# EasyEDA Pro project Valmar.eprj

# Schematic Main
Board Name: Main; Create Date: 2025-05-15; Page Name: P1; Project Name: Valmar; Schematic Name: Main; Update Date: 2025-05-19; Company: EasyEDA.com; Page Size: A4; Version: V1.0
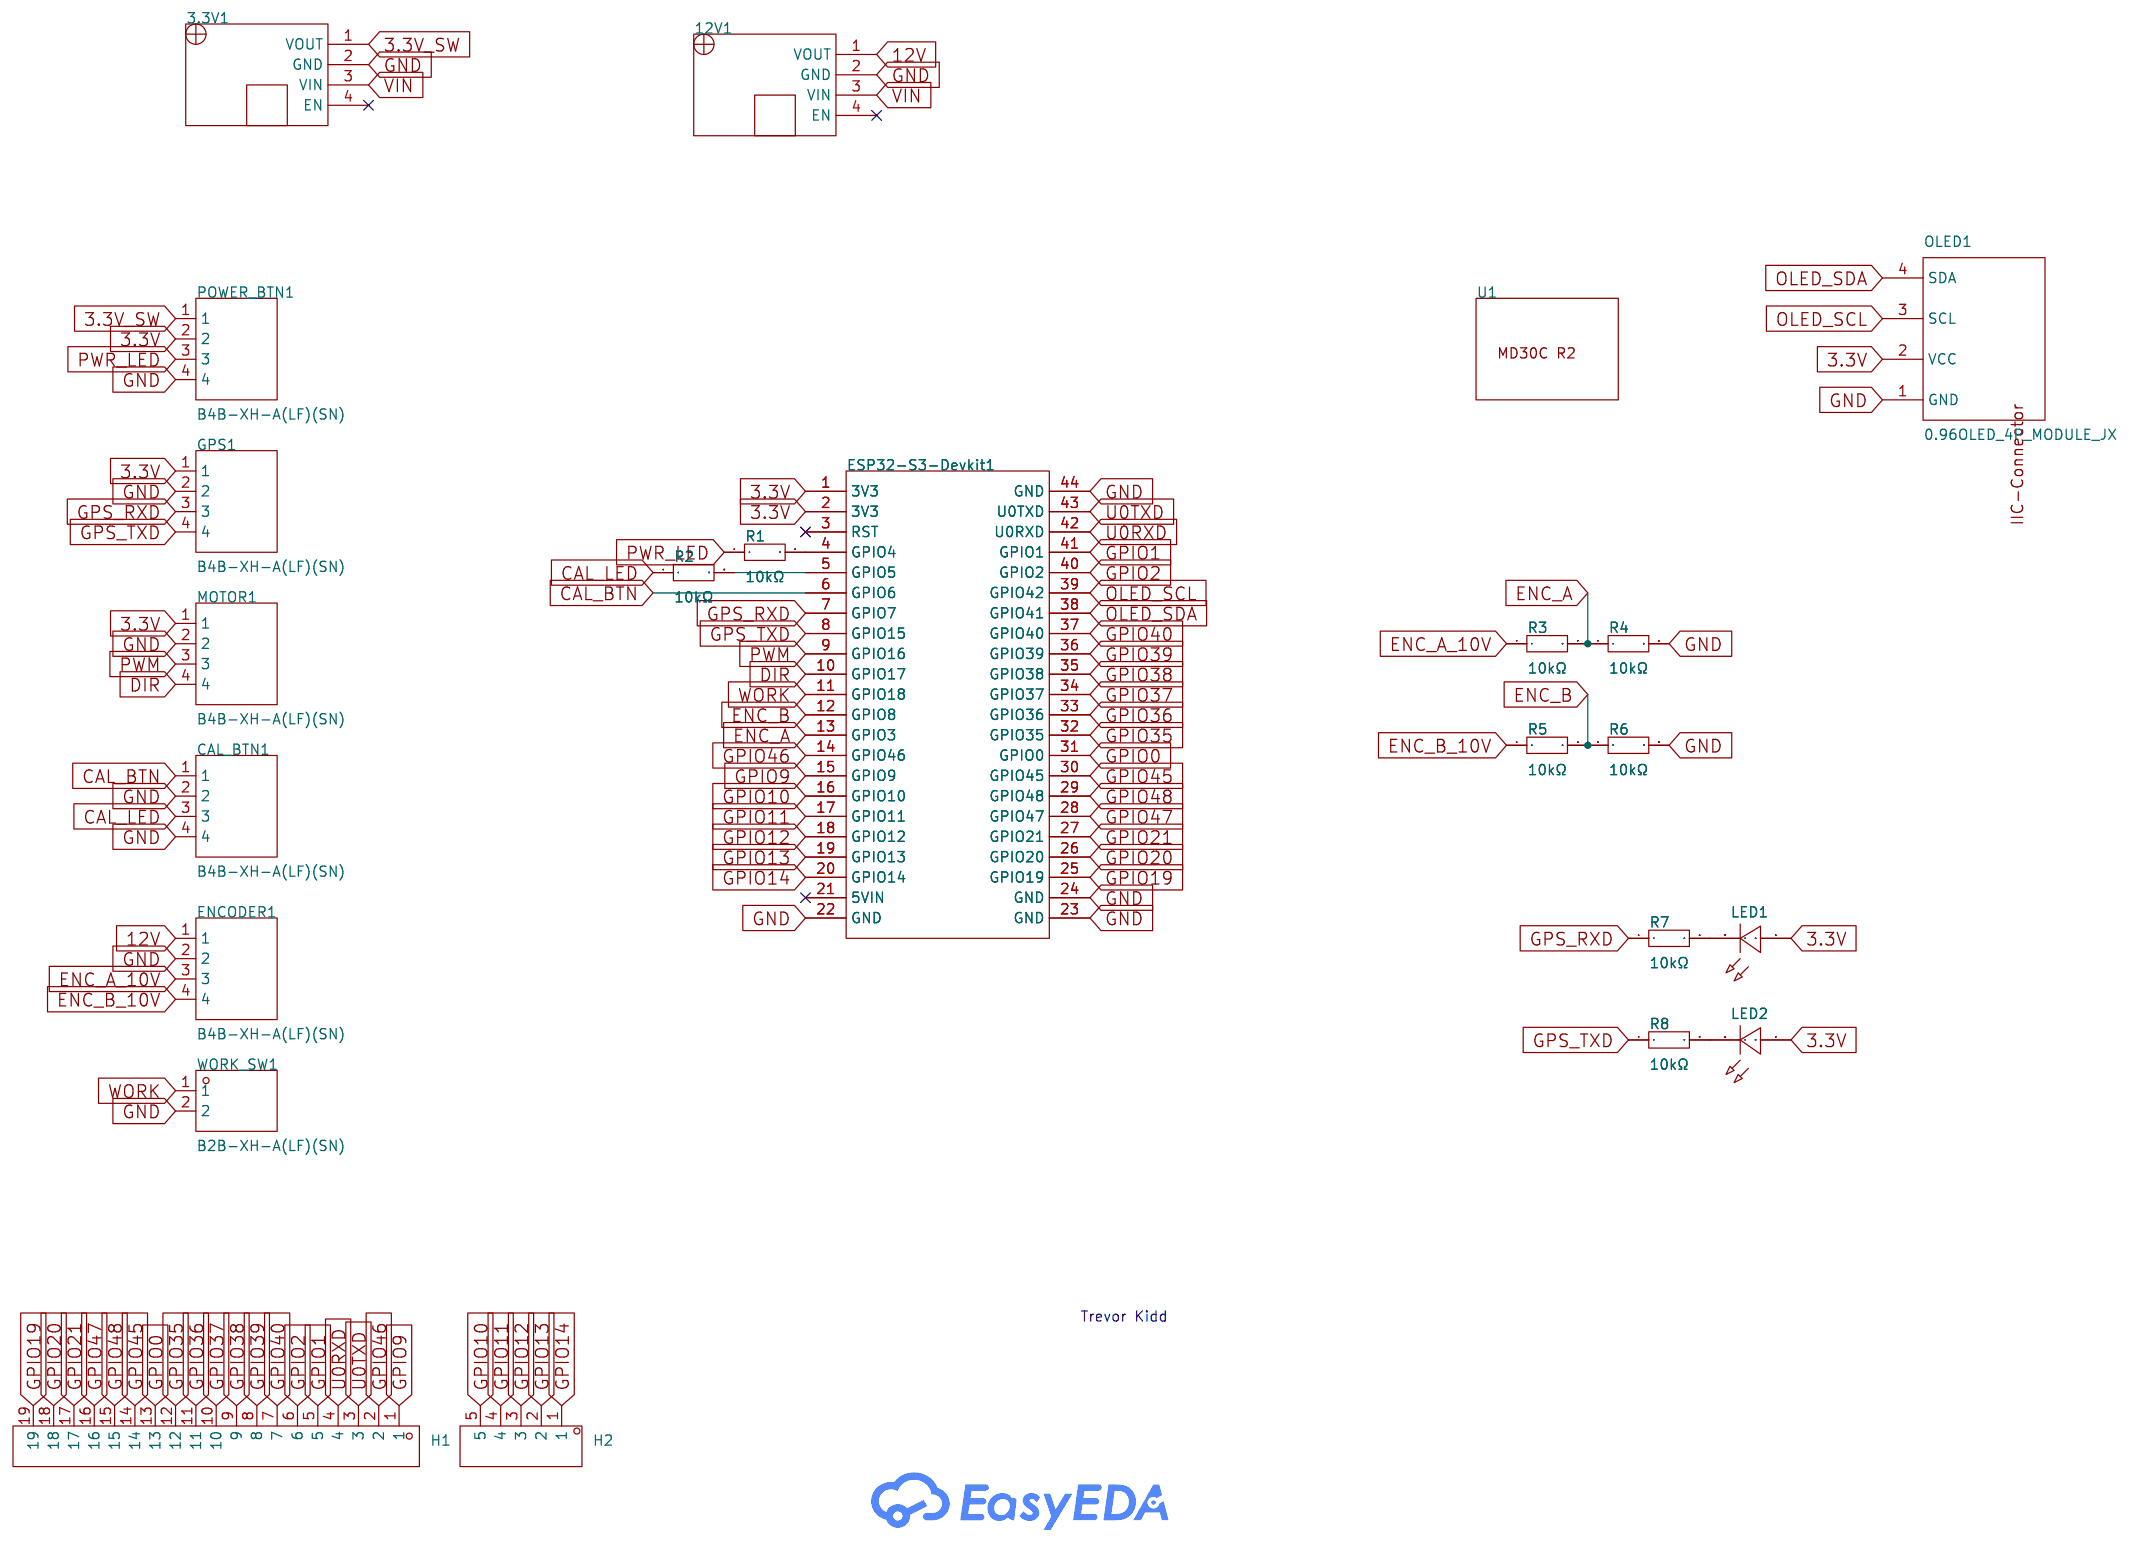
[diagram p0: schematic sheet]

## Parts
3.3V1  -  [Power Module]
12V1  -  [Power Module]
CAL_BTN1  B4B-XH-A(LF)(SN)  [CONN-TH_B4B-XH-A-LF-SN]
ENCODER1  B4B-XH-A(LF)(SN)  [CONN-TH_B4B-XH-A-LF-SN]
ESP32-S3-Devkit1  -  [ESP32-S3-Devkit]
GPS1  B4B-XH-A(LF)(SN)  [CONN-TH_B4B-XH-A-LF-SN]
H1  -  [HDR-TH_19P-P2.54-V-M]
H2  -  [HDR-TH_5P-P2.54-V-M]
LED1  -  [LED-TH_BD3.8-P2.54-FD_BLUE]
LED2  -  [LED-TH_BD3.8-P2.54-FD_BLUE]
MOTOR1  B4B-XH-A(LF)(SN)  [CONN-TH_B4B-XH-A-LF-SN]
OLED1  0.96OLED_4P_MODULE_JX  [0.96OLED_4P]
POWER_BTN1  B4B-XH-A(LF)(SN)  [CONN-TH_B4B-XH-A-LF-SN]
R1  10kΩ  [RES-TH_BD1.8-L3.2-P7.20-D0.4]
R2  10kΩ  [RES-TH_BD1.8-L3.2-P7.20-D0.4]
R3  10kΩ  [RES-TH_BD1.8-L3.2-P7.20-D0.4]
R4  10kΩ  [RES-TH_BD1.8-L3.2-P7.20-D0.4]
R5  10kΩ  [RES-TH_BD1.8-L3.2-P7.20-D0.4]
R6  10kΩ  [RES-TH_BD1.8-L3.2-P7.20-D0.4]
R7  10kΩ  [RES-TH_BD1.8-L3.2-P7.20-D0.4]
R8  10kΩ  [RES-TH_BD1.8-L3.2-P7.20-D0.4]
U1  -  [MD30C R2]
WORK_SW1  B2B-XH-A(LF)(SN)  [CONN-TH_B2B-XH-A-LF-SN]

## Library data of the parts
3.3V1 12V1 = Power Module
CAL_BTN1 ENCODER1 GPS1 MOTOR1 POWER_BTN1 = B4B-XH-A(LF)(SN): Pins Structure:1x4P Pitch:2.5mm Mounting Style:Direct Insert Reference Series:XH Number of Pins:4P Number of Rows:1 Number of PINs Per Row:4 Row Spacing:- Current Rating (Max):3A Contact Material:Brass Contact Plating:Tin Operating Temperature Range:-25℃~; LCSC Part Name: 1x4P 间距:2.5mm 直插 系列:XH; Supplier Part: C144395; Manufacturer: JST; Supplier Footprint: 插件,P=2.5mm; Datasheet: https://atta.szlcsc.com/upload/public/pdf/source/20180928/C265283_F9DFEEBDB2CF642B6BDFAB4B77BD2680.pdf; Supplier: LCSC; Pins Structure: 1x4P; Pitch: 2.5mm; Mounting Style: Direct Insert; Reference Series: XH; Number of Pins: 4P; Number of Rows: 1; Number of PINs Per Row: 4; Current Rating (Max): 3A; Contact Material: Brass; Contact Plating: Tin; Operating Temperature Range: -25℃~+85℃; Rated Voltage (Max): 250V; Plastic Material: PA66; Flame Retardant Rating: UL94V-0; Supplementary Features: K-leg punch; Colour: White; Z-Height of the Board: 7mm; X-Length of Bottom Edge on Board (Spacing Line): 12.4mm; Y-Width of Bottom Edge on Board: 5.75mm
ESP32-S3-Devkit1 = ESP32S3-Devkit
H1 = HDR-M_2.54_1x19P: Supplier Footprint: Through
H2 = HDR-M_2.54_1x5P: Supplier Footprint: Through
LED1 LED2 = LED_TH-B_3mm: Supplier Footprint: Through
OLED1 = 0.96OLED_4P_MODULE_JX: Supplier Part: C9900004566; Supplier Footprint: 插件; JLCPCB Part Class: Extended Part; Supplier: LCSC
R1-R8 = Res_AXIAL-1/8W: Supplier Footprint: Through
U1 = MD30C R2
WORK_SW1 = B2B-XH-A(LF)(SN): Pins Structure:1x2P Pitch:2.5mm Mounting Style:Direct Insert Reference Series:XH Number of Pins:2P Number of Rows:1 Number of PINs Per Row:2 Row Spacing:- Current Rating (Max):3A Contact Material:Brass Contact Plating:Tin Operating Temperature Range:-25℃~; LCSC Part Name: 1x2P 间距:2.5mm 直插 系列:XH; Supplier Part: C158012; Manufacturer: JST; Supplier Footprint: 插件,P=2.5mm; Datasheet: https://atta.szlcsc.com/upload/public/pdf/source/20180928/C265283_F9DFEEBDB2CF642B6BDFAB4B77BD2680.pdf; Supplier: LCSC; Pins Structure: 1x2P; Pitch: 2.5mm; Mounting Style: Direct Insert; Reference Series: XH; Number of Pins: 2P; Number of Rows: 1; Number of PINs Per Row: 2; Current Rating (Max): 3A; Contact Material: Brass; Contact Plating: Tin; Operating Temperature Range: -25℃~+85℃; Rated Voltage (Max): 250V; Plastic Material: PA66; Flame Retardant Rating: UL94V-0; Supplementary Features: K-leg punch; Colour: White; Z-Height of the Board: 7mm; X-Length of Bottom Edge on Board (Spacing Line): 7.4mm; Y-Width of Bottom Edge on Board: 5.75mm

## Nets
3.3V: ESP32-S3-Devkit1.1(3V3) ESP32-S3-Devkit1.2(3V3) GPS1.1 LED1.1(C) LED2.1(C) MOTOR1.1 OLED1.2(VCC) POWER_BTN1.2
3.3V_SW: 3.3V1.1(VOUT) POWER_BTN1.1
12V: 12V1.1(VOUT) ENCODER1.1
GND: 3.3V1.2(GND) 12V1.2(GND) CAL_BTN1.2 CAL_BTN1.4 ENCODER1.2 ESP32-S3-Devkit1.22(GND) ESP32-S3-Devkit1.23(GND) ESP32-S3-Devkit1.24(GND) ESP32-S3-Devkit1.44(GND) GPS1.2 MOTOR1.2 OLED1.1(GND) POWER_BTN1.4 R4.2 R6.2 WORK_SW1.2
VIN: 3.3V1.3(VIN) 12V1.3(VIN)
CAL_BTN: CAL_BTN1.1 ESP32-S3-Devkit1.6(GPIO6)
CAL_LED: CAL_BTN1.3 R2.1
DIR: ESP32-S3-Devkit1.10(GPIO17) MOTOR1.4
ENC_A: ESP32-S3-Devkit1.13(GPIO3) R3.2 R4.1
ENC_A_10V: ENCODER1.3 R3.1
ENC_B: ESP32-S3-Devkit1.12(GPIO8) R5.2 R6.1
ENC_B_10V: ENCODER1.4 R5.1
GPIO0: ESP32-S3-Devkit1.31(GPIO0) H1.13
GPIO1: ESP32-S3-Devkit1.41(GPIO1) H1.5
GPIO2: ESP32-S3-Devkit1.40(GPIO2) H1.6
GPIO9: ESP32-S3-Devkit1.15(GPIO9) H1.1
GPIO10: ESP32-S3-Devkit1.16(GPIO10) H2.5
GPIO11: ESP32-S3-Devkit1.17(GPIO11) H2.4
GPIO12: ESP32-S3-Devkit1.18(GPIO12) H2.3
GPIO13: ESP32-S3-Devkit1.19(GPIO13) H2.2
GPIO14: ESP32-S3-Devkit1.20(GPIO14) H2.1
GPIO19: ESP32-S3-Devkit1.25(GPIO19) H1.19
GPIO20: ESP32-S3-Devkit1.26(GPIO20) H1.18
GPIO21: ESP32-S3-Devkit1.27(GPIO21) H1.17
GPIO35: ESP32-S3-Devkit1.32(GPIO35) H1.12
GPIO36: ESP32-S3-Devkit1.33(GPIO36) H1.11
GPIO37: ESP32-S3-Devkit1.34(GPIO37) H1.10
GPIO38: ESP32-S3-Devkit1.35(GPIO38) H1.9
GPIO39: ESP32-S3-Devkit1.36(GPIO39) H1.8
GPIO40: ESP32-S3-Devkit1.37(GPIO40) H1.7
GPIO45: ESP32-S3-Devkit1.30(GPIO45) H1.14
GPIO46: ESP32-S3-Devkit1.14(GPIO46) H1.2
GPIO47: ESP32-S3-Devkit1.28(GPIO47) H1.16
GPIO48: ESP32-S3-Devkit1.29(GPIO48) H1.15
GPS_RXD: ESP32-S3-Devkit1.7(GPIO7) GPS1.3 R7.1
GPS_TXD: ESP32-S3-Devkit1.8(GPIO15) GPS1.4 R8.1
OLED_SCL: ESP32-S3-Devkit1.39(GPIO42) OLED1.3(SCL)
OLED_SDA: ESP32-S3-Devkit1.38(GPIO41) OLED1.4(SDA)
PWM: ESP32-S3-Devkit1.9(GPIO16) MOTOR1.3
PWR_LED: POWER_BTN1.3 R1.1
U0RXD: ESP32-S3-Devkit1.42(U0RXD) H1.4
U0TXD: ESP32-S3-Devkit1.43(U0TXD) H1.3
WORK: ESP32-S3-Devkit1.11(GPIO18) WORK_SW1.1
$1N2047: ESP32-S3-Devkit1.4(GPIO4) R1.2
$1N2051: ESP32-S3-Devkit1.5(GPIO5) R2.2
Net-(LED1-2): LED1.2(A) R7.2
Net-(LED2-2): LED2.2(A) R8.2

Not connected (* = marked no-connect by the designer): 3.3V1 4(EN)*; 12V1 4(EN)*; ESP32-S3-Devkit1 3(RST)* 21(5VIN)*

## Notes on the sheet
- Trevor Kidd

# Board Main PCB
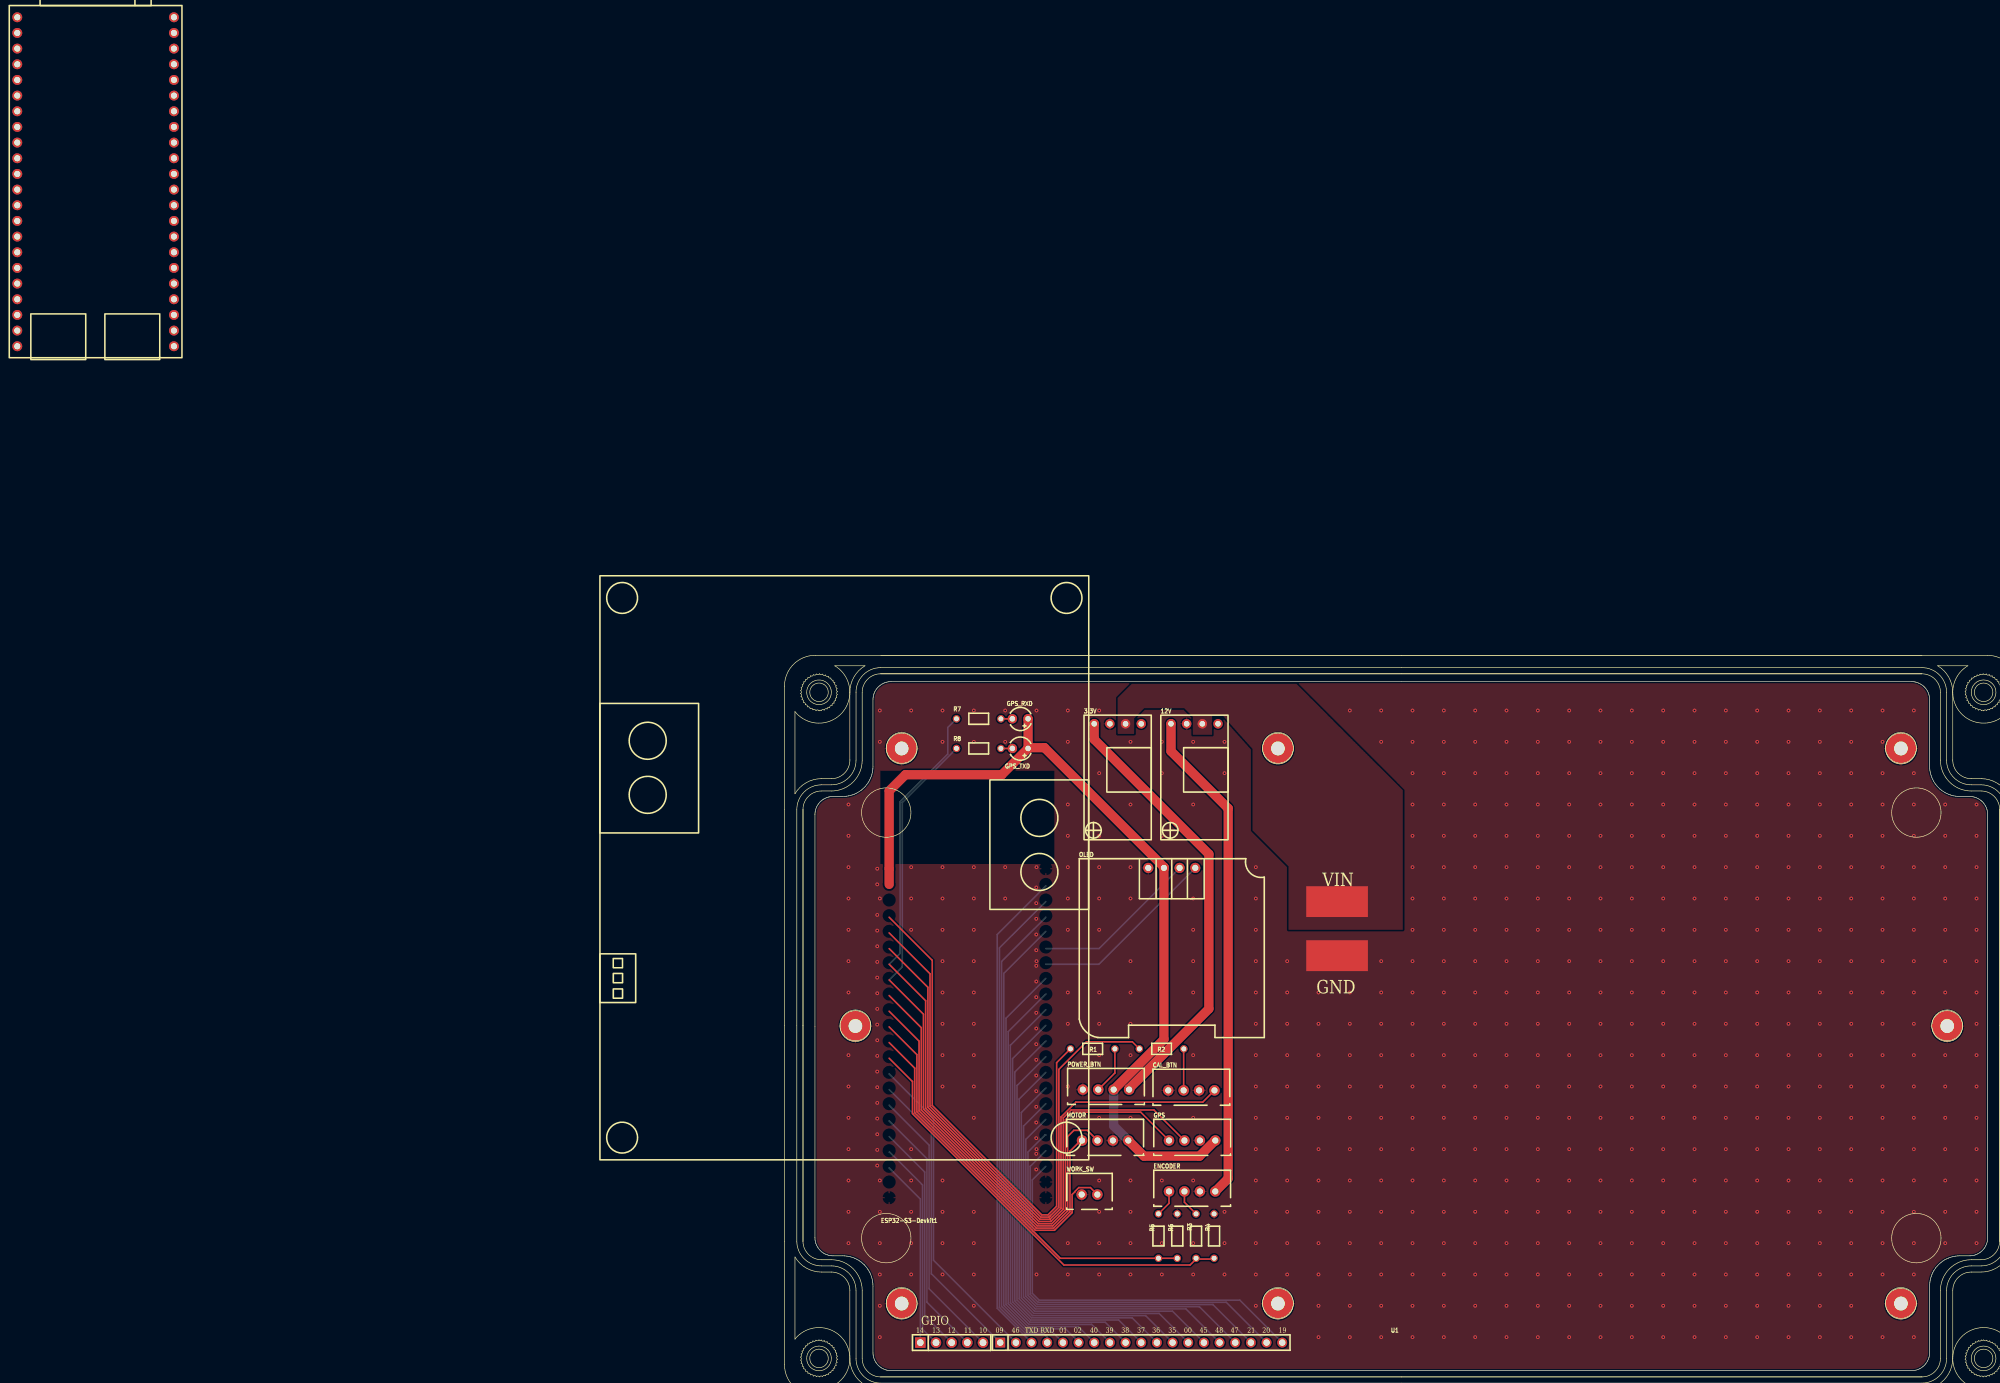
[diagram p1: board, top side]
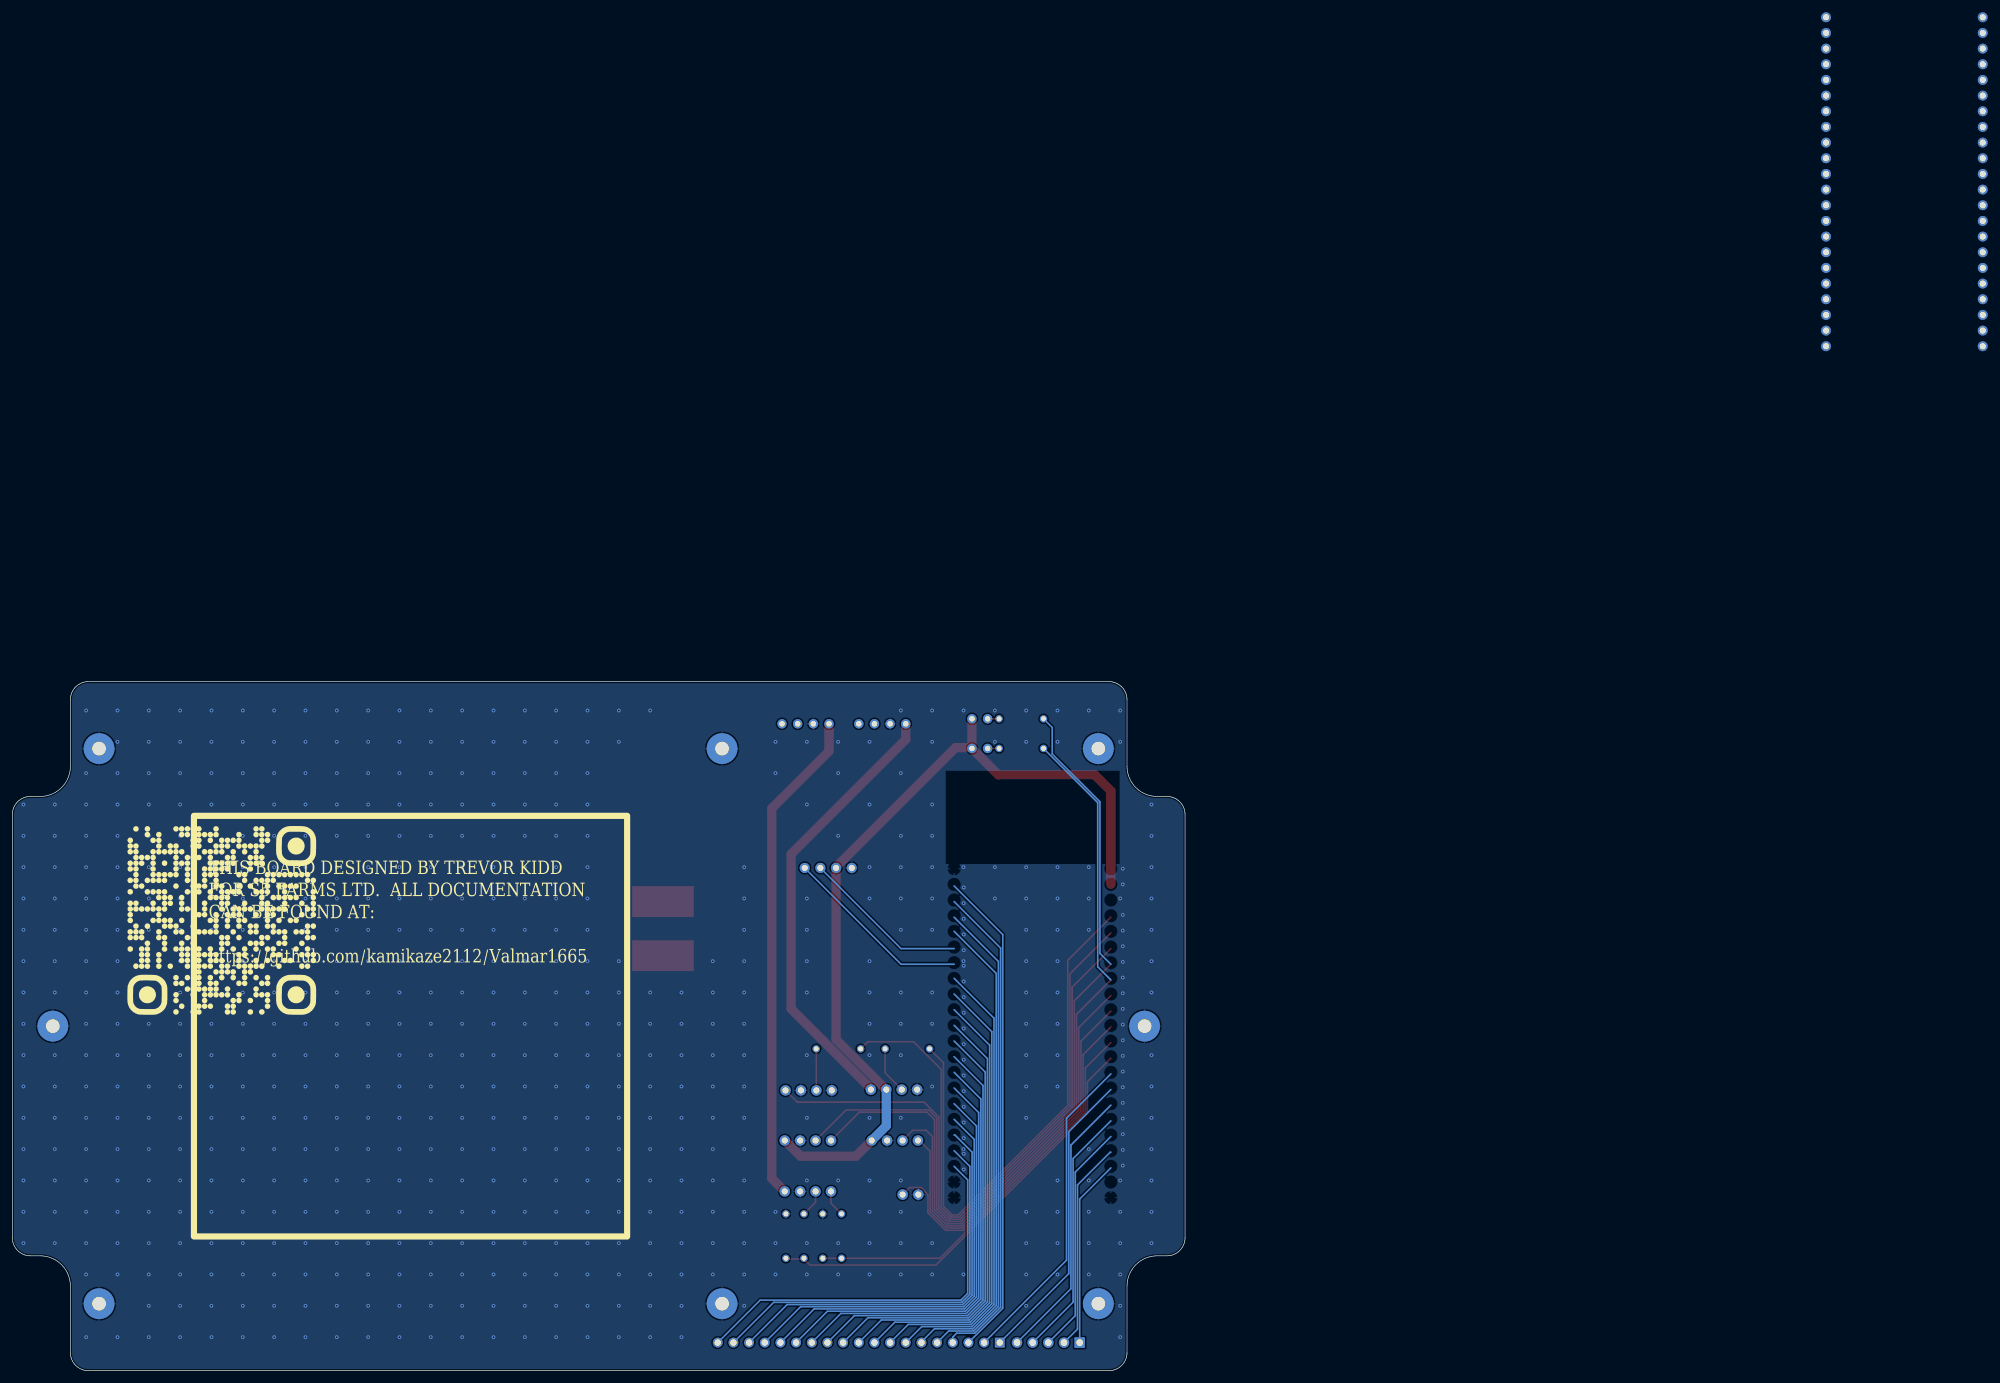
[diagram p2: board, bottom side, seen from below]

Outline 190.12 x 111.72 mm; copper layers: Top Layer, Bottom Layer. Coordinates in mm from the lower left corner of the outline.
Stack: Top Layer 0.035mm / Dielectric1 1.51mm FR4 er 4.5 / Bottom Layer 0.035mm

## Design rules (mm)
template: Custom Config
spacing copperThickness1oz (default): track to track 0.102, other pairs 0.152 to 0.3
spacing copperThickness2oz: track to track 0.203, other pairs 0.152 to 0.3
track width copperThickness1oz (default): min 0.127, default 0.254, max 2.54
track width copperThickness2oz: min 0.203, default 0.254, max 2.54
differential pair differentialPair (default): width min 0.127, default 0.254, max 2.54; gap min 0.152, default 0.152
via viaSize (default): diameter min 0.5, default 0.61, max 10; hole min 0.3, default 0.305, max 6.3
pour e535 uses copperRegion1

## Placement (name value [footprint] x y rotation side)
3.3V  -  [Power Module]  157.93 -6.37 0 top
12V  -  [Power Module]  170.37 -6.37 0 top
CAL_BTN  B4B-XH-A(LF)(SN)  [CONN-TH_B4B-XH-A-LF-SN]  61.02 45.45 0 top
ENCODER  B4B-XH-A(LF)(SN)  [CONN-TH_B4B-XH-A-LF-SN]  61.15 29.06 0 top
ESP32-S3-Devkit1  -  [ESP32-S3-Devkit]  10.73 83.29 0 top
GPS  B4B-XH-A(LF)(SN)  [CONN-TH_B4B-XH-A-LF-SN]  61.15 37.32 0 top
GPS_RXD  -  [LED-TH_BD3.8-P2.54-FD_BLUE]  33.28 105.69 180 top
GPS_TXD  -  [LED-TH_BD3.8-P2.54-FD_BLUE]  33.28 100.88 180 top
H1  -  [HDR-TH_19P-P2.54-V-M]  52.9 4.55 0 top
H2  -  [HDR-TH_5P-P2.54-V-M]  22.16 4.55 0 top
MOTOR  B4B-XH-A(LF)(SN)  [CONN-TH_B4B-XH-A-LF-SN]  47.05 37.32 0 top
NOREF  -  [Pad_e1364]  176.06 10.86 0 top
NOREF#2  -  [Pad_e1367]  75.06 100.86 0 top
NOREF#3  -  [Pad_e1369]  6.56 55.86 0 top
NOREF#4  -  [Pad_e1373]  84.65 67.29 0 top
NOREF#5  -  [Pad_e1372]  84.65 76.05 0 top
NOREF#6  -  [Pad_e1365]  183.56 55.86 0 top
NOREF#7  -  [Pad_e1368]  14.06 100.86 0 top
NOREF#8  -  [Pad_e1366]  176.06 100.86 0 top
NOREF#9  -  [Pad_e1362]  14.06 10.86 0 top
NOREF#10  -  [Pad_e1363]  75.06 10.86 0 top
OLED  0.96OLED_4P_MODULE_JX  [0.96OLED_4P]  57.85 81.51 0 top
POWER_BTN  B4B-XH-A(LF)(SN)  [CONN-TH_B4B-XH-A-LF-SN]  47.18 45.57 0 top
R1  10kΩ  [RES-TH_BD1.8-L3.2-P7.20-D0.4]  45.02 52.18 180 top
R2  10kΩ  [RES-TH_BD1.8-L3.2-P7.20-D0.4]  56.2 52.18 180 top
R3  10kΩ  [RES-TH_BD1.8-L3.2-P7.20-D0.4]  61.79 21.82 270 top
R4  10kΩ  [RES-TH_BD1.8-L3.2-P7.20-D0.4]  64.71 21.82 90 top
R5  10kΩ  [RES-TH_BD1.8-L3.2-P7.20-D0.4]  55.69 21.82 270 top
R6  10kΩ  [RES-TH_BD1.8-L3.2-P7.20-D0.4]  58.74 21.82 90 top
R7  10kΩ  [RES-TH_BD1.8-L3.2-P7.20-D0.4]  26.55 105.69 0 top
R8  10kΩ  [RES-TH_BD1.8-L3.2-P7.20-D0.4]  26.55 100.88 0 top
U1  -  [MD30C R2]  93.41 8.11 0 top
WORK_SW  B2B-XH-A(LF)(SN)  [CONN-TH_B2B-XH-A-LF-SN]  44.51 28.56 0 top

## Footprints (pads in the part's own frame, mm; a bottom-side part is the same pattern mirrored in y, then rotated)
0.96OLED_4P
  round 1.65 hole 1: 1(-3.81,-0.002) 2(-1.27,0.002) 3(1.27,0.002) 4(3.81,0.002)
CONN-TH_B2B-XH-A-LF-SN
  round 1.7 hole 1: 1(1.27,0) 2(-1.27,0)
CONN-TH_B4B-XH-A-LF-SN
  round 1.7 hole 1: 1(3.75,0) 2(1.25,0) 3(-1.25,0) 4(-3.75,0)
ESP32-S3-Devkit
  round 1.6 hole 1: 1(-140.051,136.144) 2(-140.051,133.604) 3(-140.051,131.064) 4(-140.051,128.524) 5(-140.051,125.984) 6(-140.051,123.444) 7(-140.051,120.904) 8(-140.051,118.364) 9(-140.051,115.824) 10(-140.051,113.284) 11(-140.051,110.744) 12(-140.051,108.204) 13(-140.051,105.664) 14(-140.051,103.124) 15(-140.051,100.584) 16(-140.051,98.044) 17(-140.051,95.504) 18(-140.051,92.964) 19(-140.051,90.424) 20(-140.051,87.884) 21(-140.051,85.344) 22(-140.051,82.804) 23(-114.651,82.804) 24(-114.651,85.344) 25(-114.651,87.884) 26(-114.651,90.424) 27(-114.651,92.964) 28(-114.651,95.504) 29(-114.651,98.044) 30(-114.651,100.584) 31(-114.651,103.124) 32(-114.651,105.664) 33(-114.651,108.204) 34(-114.651,110.744) 35(-114.651,113.284) 36(-114.651,115.824) 37(-114.651,118.364) 38(-114.651,120.904) 39(-114.651,123.444) 40(-114.651,125.984) 41(-114.651,128.524) 42(-114.651,131.064) 43(-114.651,133.604) 44(-114.651,136.144)
HDR-TH_5P-P2.54-V-M
  rect 1.7x1.7 hole 1.1: 1(-5.08,0)
  round 1.7 hole 1.1: 2(-2.54,0) 3(0,0) 4(2.54,0) 5(5.08,0)
HDR-TH_19P-P2.54-V-M
  rect 1.6x1.6 hole 1.05: 1(-22.86,0)
  round 1.6 hole 1.05: 2(-20.32,0) 3(-17.78,0) 4(-15.24,0) 5(-12.7,0) 6(-10.16,0) 7(-7.62,0) 8(-5.08,0) 9(-2.54,0) 10(0,0) 11(2.54,0) 12(5.08,0) 13(7.62,0) 14(10.16,0) 15(12.7,0) 16(15.24,0) 17(17.78,0) 18(20.32,0) 19(22.86,0)
LED-TH_BD3.8-P2.54-FD_BLUE
  round 1.524 hole 0.9: 1(-1.27,0) 2(1.27,0)
Pad_e1362
  round 5 hole 2.2: 1(0,0)
Pad_e1363
  round 5 hole 2.2: 2(0,0)
Pad_e1364
  round 5 hole 2.2: 3(0,0)
Pad_e1365
  round 5 hole 2.2: 4(0,0)
Pad_e1366
  round 5 hole 2.2: 5(0,0)
Pad_e1367
  round 5 hole 2.2: 6(0,0)
Pad_e1368
  round 5 hole 2.2: 7(0,0)
Pad_e1369
  round 5 hole 2.2: 8(0,0)
Pad_e1372
  rect 10x5 smd: 1(0,0)
Pad_e1373
  rect 10x5 smd: 2(0,0)
Power Module
  round 1.524 hole 0.914: 1(-112.649,111.252) 2(-110.109,111.252) 3(-107.569,111.252) 4(-105.029,111.252)
RES-TH_BD1.8-L3.2-P7.20-D0.4
  round 1.2 hole 0.8: 1(-3.6,0) 2(3.6,0)

## Nets
3.3V: ESP32-S3-Devkit1.1 ESP32-S3-Devkit1.2 GPS.1 GPS_RXD.1 GPS_TXD.1 MOTOR.1 OLED.2 POWER_BTN.2
3.3V_SW: 3.3V.1 POWER_BTN.1
12V: 12V.1 ENCODER.1
GND: 3.3V.2 12V.2 CAL_BTN.2 CAL_BTN.4 ENCODER.2 ESP32-S3-Devkit1.22 ESP32-S3-Devkit1.23 ESP32-S3-Devkit1.24 ESP32-S3-Devkit1.44 GPS.2 MOTOR.2 NOREF.3 NOREF#2.6 NOREF#3.8 NOREF#4.2 NOREF#6.4 NOREF#7.7 NOREF#8.5 NOREF#9.1 NOREF#10.2 OLED.1 POWER_BTN.4 R4.2 R6.2 WORK_SW.2
VIN: 3.3V.3 12V.3 NOREF#5.1
CAL_BTN: CAL_BTN.1 ESP32-S3-Devkit1.6
CAL_LED: CAL_BTN.3 R2.1
DIR: ESP32-S3-Devkit1.10 MOTOR.4
ENC_A: ESP32-S3-Devkit1.13 R3.2 R4.1
ENC_A_10V: ENCODER.3 R3.1
ENC_B: ESP32-S3-Devkit1.12 R5.2 R6.1
ENC_B_10V: ENCODER.4 R5.1
GPIO0: ESP32-S3-Devkit1.31 H1.13
GPIO1: ESP32-S3-Devkit1.41 H1.5
GPIO2: ESP32-S3-Devkit1.40 H1.6
GPIO9: ESP32-S3-Devkit1.15 H1.1
GPIO10: ESP32-S3-Devkit1.16 H2.5
GPIO11: ESP32-S3-Devkit1.17 H2.4
GPIO12: ESP32-S3-Devkit1.18 H2.3
GPIO13: ESP32-S3-Devkit1.19 H2.2
GPIO14: ESP32-S3-Devkit1.20 H2.1
GPIO19: ESP32-S3-Devkit1.25 H1.19
GPIO20: ESP32-S3-Devkit1.26 H1.18
GPIO21: ESP32-S3-Devkit1.27 H1.17
GPIO35: ESP32-S3-Devkit1.32 H1.12
GPIO36: ESP32-S3-Devkit1.33 H1.11
GPIO37: ESP32-S3-Devkit1.34 H1.10
GPIO38: ESP32-S3-Devkit1.35 H1.9
GPIO39: ESP32-S3-Devkit1.36 H1.8
GPIO40: ESP32-S3-Devkit1.37 H1.7
GPIO45: ESP32-S3-Devkit1.30 H1.14
GPIO46: ESP32-S3-Devkit1.14 H1.2
GPIO47: ESP32-S3-Devkit1.28 H1.16
GPIO48: ESP32-S3-Devkit1.29 H1.15
GPS_RXD: ESP32-S3-Devkit1.7 GPS.3 R7.1
GPS_TXD: ESP32-S3-Devkit1.8 GPS.4 R8.1
OLED_SCL: ESP32-S3-Devkit1.39 OLED.3
OLED_SDA: ESP32-S3-Devkit1.38 OLED.4
PWM: ESP32-S3-Devkit1.9 MOTOR.3
PWR_LED: POWER_BTN.3 R1.1
U0RXD: ESP32-S3-Devkit1.42 H1.4
U0TXD: ESP32-S3-Devkit1.43 H1.3
WORK: ESP32-S3-Devkit1.11 WORK_SW.1
$1N1645: GPS_TXD.2 R8.2
$1N1646: GPS_RXD.2 R7.2
$1N2047: ESP32-S3-Devkit1.4 R1.2
$1N2051: ESP32-S3-Devkit1.5 R2.2

Pads without a net: 3.3V 4; 12V 4; ESP32-S3-Devkit1 3 21

## Via types
v1: diameter 0.61, hole 0.305, Top Layer to Bottom Layer, 618 vias

## Routing (per net, layer and track width the routed paths; a pad name or vN(x,y) marks a point on that pad's centre or on a via; arc(x,y) is an arc through that point)
3.3V: length 140.3
  Top Layer w1.5: 34.55,100.88 34.55,105.69 ; 34.55,100.88 34.68,101.01 37.21,101.01 56.58,81.64 56.58,53.7 48.45,45.57 POWER_BTN.2 ; 34.55,100.88 30.29,96.63 14.67,96.63 12.03,93.99 12.03,78.85 ; MOTOR.1 53.34,34.78 62.34,34.78 64.88,37.32 GPS.1
  Bottom Layer w1.5: MOTOR.1 48.43,39.69 POWER_BTN.2
3.3V_SW: length 72.4
  Top Layer w1.5: 3.3V.1 45.28,102.34 63.86,83.76 63.86,58.67 50.93,45.74 POWER_BTN.1
12V: length 80.5
  Top Layer w1.5: 12V.1 57.72,100.44 66.99,91.17 66.99,31.16 ENCODER.1
GND:
  vias: v1(5.44,91.8) v1(5.44,86.72) v1(5.44,81.64) v1(5.44,76.56) v1(5.44,71.48) v1(5.44,66.4) v1(5.44,61.32) v1(5.44,51.16) v1(5.44,46.08) v1(5.44,41) v1(5.44,35.92) v1(5.44,30.84) v1(5.44,25.76) v1(5.44,20.68) v1(10.1,81.39) v1(10.1,78.85) v1(10.1,73.89) v1(10.1,71.35) v1(10.1,68.81) v1(10.1,66.27) v1(10.1,63.73) v1(10.1,61.19) v1(10.1,58.65) v1(10.1,56.11) v1(10.1,53.57) v1(10.1,51.03) v1(10.1,48.49) v1(10.1,45.95) v1(10.1,43.41) v1(10.1,40.87) v1(10.1,38.33) v1(10.1,35.79) v1(10.1,33.25) v1(10.52,107.04) v1(10.52,101.96) v1(10.52,76.56) v1(10.52,30.84) v1(10.52,25.76) v1(10.52,20.68) v1(10.52,15.6) v1(10.52,10.52) v1(10.52,5.44) v1(15.6,107.04) v1(15.6,81.64) v1(15.6,76.56) v1(15.6,71.48) v1(15.6,35.92) v1(15.6,30.84) v1(15.6,25.76) v1(15.6,20.68) v1(15.6,15.6) v1(20.68,107.04) v1(20.68,101.96) v1(20.68,81.64) v1(20.68,76.56) v1(20.68,71.48) v1(20.68,66.4) v1(20.68,61.32) v1(20.68,56.24) v1(20.68,51.16) v1(20.68,46.08) v1(20.68,30.84) v1(20.68,25.76) v1(20.68,20.68) v1(20.68,15.6) v1(25.76,107.04) v1(25.76,101.96) v1(25.76,81.64) v1(25.76,76.56) v1(25.76,71.48) v1(25.76,66.4) v1(25.76,61.32) v1(25.76,56.24) v1(25.76,51.16) v1(25.76,46.08) v1(25.76,41) v1(25.76,25.76) v1(25.76,20.68) v1(25.76,15.6) v1(25.76,10.52) v1(30.84,107.04) v1(30.84,101.96) v1(30.84,81.64) v1(30.84,76.56) v1(35.88,78.34) v1(35.88,75.8) v1(35.88,73.26) v1(35.88,70.72) v1(35.88,68.18) v1(35.88,65.64) v1(35.88,63.1) v1(35.88,60.56) v1(35.88,58.02) v1(35.88,55.48) v1(35.88,52.94) v1(35.88,50.4) v1(35.88,47.86) v1(35.88,45.32) v1(35.88,42.78) v1(35.88,40.24) v1(35.88,37.7) v1(35.88,35.16) v1(35.88,32.62) v1(35.92,107.04) v1(35.92,81.64) v1(35.92,66.4) v1(35.92,35.92) v1(35.92,15.6) v1(41,107.04) v1(41,101.96) v1(41,91.8) v1(41,86.72) v1(41,81.64) v1(41,76.56) v1(41,71.48) v1(41,61.32) v1(41,56.24) v1(41,46.08) v1(41,20.68) v1(41,15.6) v1(46.08,107.04) v1(46.08,96.88) v1(46.08,86.72) v1(46.08,81.64) v1(46.08,76.56) v1(46.08,71.48) v1(46.08,61.32) v1(46.08,56.24) v1(46.08,51.16) v1(46.08,41) v1(46.08,30.84) v1(46.08,25.76) v1(46.08,20.68) v1(46.08,15.6) v1(51.16,101.96) v1(51.16,91.8) v1(51.16,81.64) v1(51.16,76.56) v1(51.16,66.4) v1(51.16,61.32) v1(51.16,56.24) v1(51.16,51.16) v1(51.16,41) v1(51.16,30.84) v1(51.16,25.76) v1(51.16,20.68) v1(51.16,15.6) v1(56.24,101.96) v1(56.24,96.88) v1(56.24,86.72) v1(56.24,30.84) v1(56.24,20.68) v1(56.24,15.6) v1(61.32,101.96) v1(61.32,91.8) v1(61.32,76.56) v1(61.32,71.48) v1(61.32,66.4) v1(61.32,61.32) v1(61.32,51.16) v1(61.32,41) v1(61.32,30.84) v1(61.32,20.68) v1(61.32,15.6) v1(66.4,101.96) v1(66.4,96.88) v1(66.4,25.76) v1(66.4,20.68) v1(66.4,15.6) v1(71.48,81.64) v1(71.48,76.56) v1(71.48,71.48) v1(71.48,66.4) v1(71.48,61.32) v1(71.48,56.24) v1(71.48,51.16) v1(71.48,46.08) v1(71.48,41) v1(71.48,35.92) v1(71.48,30.84) v1(71.48,25.76) v1(71.48,20.68) v1(71.48,15.6) v1(71.48,10.52) v1(76.56,66.4) v1(76.56,61.32) v1(76.56,56.24) v1(76.56,51.16) v1(76.56,46.08) v1(76.56,41) v1(76.56,35.92) v1(76.56,30.84) v1(76.56,25.76) v1(76.56,20.68) v1(76.56,15.6) v1(81.64,61.32) v1(81.64,56.24) v1(81.64,51.16) v1(81.64,46.08) v1(81.64,41) v1(81.64,35.92) v1(81.64,30.84) v1(81.64,25.76) v1(81.64,20.68) v1(81.64,15.6) v1(81.64,10.52) v1(81.64,5.44) v1(86.72,107.04) v1(86.72,61.32) v1(86.72,56.24) v1(86.72,51.16) v1(86.72,46.08) v1(86.72,41) v1(86.72,35.92) v1(86.72,30.84) v1(86.72,25.76) v1(86.72,20.68) v1(86.72,15.6) v1(86.72,10.52) v1(86.72,5.44) v1(91.8,107.04) v1(91.8,101.96) v1(91.8,66.4) v1(91.8,61.32) v1(91.8,56.24) v1(91.8,51.16) v1(91.8,46.08) v1(91.8,41) v1(91.8,35.92) v1(91.8,30.84) v1(91.8,25.76) v1(91.8,20.68) v1(91.8,15.6) v1(91.8,10.52) v1(91.8,5.44) v1(96.88,107.04) v1(96.88,101.96) v1(96.88,96.88) v1(96.88,91.8) v1(96.88,86.72) v1(96.88,81.64) v1(96.88,76.56) v1(96.88,71.48) v1(96.88,66.4) v1(96.88,61.32) v1(96.88,56.24) v1(96.88,51.16) v1(96.88,46.08) v1(96.88,41) v1(96.88,35.92) v1(96.88,30.84) v1(96.88,25.76) v1(96.88,20.68) v1(96.88,15.6) v1(96.88,10.52) v1(96.88,5.44) v1(101.96,107.04) v1(101.96,101.96) v1(101.96,96.88) v1(101.96,91.8) v1(101.96,86.72) v1(101.96,81.64) v1(101.96,76.56) v1(101.96,71.48) v1(101.96,66.4) v1(101.96,61.32) v1(101.96,56.24) v1(101.96,51.16) v1(101.96,46.08) v1(101.96,41) v1(101.96,35.92) v1(101.96,30.84) v1(101.96,25.76) v1(101.96,20.68) v1(101.96,15.6) v1(101.96,10.52) v1(101.96,5.44) v1(107.04,107.04) v1(107.04,101.96) v1(107.04,96.88) v1(107.04,91.8) v1(107.04,86.72) v1(107.04,81.64) v1(107.04,76.56) v1(107.04,71.48) v1(107.04,66.4) v1(107.04,61.32) v1(107.04,56.24) v1(107.04,51.16) v1(107.04,46.08) v1(107.04,41) v1(107.04,35.92) v1(107.04,30.84) v1(107.04,25.76) v1(107.04,20.68) v1(107.04,15.6) v1(107.04,10.52) v1(107.04,5.44) v1(112.12,107.04) v1(112.12,101.96) v1(112.12,96.88) v1(112.12,91.8) v1(112.12,86.72) v1(112.12,81.64) v1(112.12,76.56) v1(112.12,71.48) v1(112.12,66.4) v1(112.12,61.32) v1(112.12,56.24) v1(112.12,51.16) v1(112.12,46.08) v1(112.12,41) v1(112.12,35.92) v1(112.12,30.84) v1(112.12,25.76) v1(112.12,20.68) v1(112.12,15.6) v1(112.12,10.52) v1(112.12,5.44) v1(117.2,107.04) v1(117.2,101.96) v1(117.2,96.88) v1(117.2,91.8) v1(117.2,86.72) v1(117.2,81.64) v1(117.2,76.56) v1(117.2,71.48) v1(117.2,66.4) v1(117.2,61.32) v1(117.2,56.24) v1(117.2,51.16) v1(117.2,46.08) v1(117.2,41) v1(117.2,35.92) v1(117.2,30.84) v1(117.2,25.76) v1(117.2,20.68) v1(117.2,15.6) v1(117.2,10.52) v1(117.2,5.44) v1(122.28,107.04) v1(122.28,101.96) v1(122.28,96.88) v1(122.28,91.8) v1(122.28,86.72) v1(122.28,81.64) v1(122.28,76.56) v1(122.28,71.48) v1(122.28,66.4) v1(122.28,61.32) v1(122.28,56.24) v1(122.28,51.16) v1(122.28,46.08) v1(122.28,41) v1(122.28,35.92) v1(122.28,30.84) v1(122.28,25.76) v1(122.28,20.68) v1(122.28,15.6) v1(122.28,10.52) v1(122.28,5.44) v1(127.36,107.04) v1(127.36,101.96) v1(127.36,96.88) v1(127.36,91.8) v1(127.36,86.72) v1(127.36,81.64) v1(127.36,76.56) v1(127.36,71.48) v1(127.36,66.4) v1(127.36,61.32) v1(127.36,56.24) v1(127.36,51.16) v1(127.36,46.08) v1(127.36,41) v1(127.36,35.92) v1(127.36,30.84) v1(127.36,25.76) v1(127.36,20.68) v1(127.36,15.6) v1(127.36,10.52) v1(127.36,5.44) v1(132.44,107.04) v1(132.44,101.96) v1(132.44,96.88) v1(132.44,91.8) v1(132.44,86.72) v1(132.44,81.64) v1(132.44,76.56) v1(132.44,71.48) v1(132.44,66.4) v1(132.44,61.32) v1(132.44,56.24) v1(132.44,51.16) v1(132.44,46.08) v1(132.44,41) v1(132.44,35.92) v1(132.44,30.84) v1(132.44,25.76) v1(132.44,20.68) v1(132.44,15.6) v1(132.44,10.52) v1(132.44,5.44) v1(137.52,107.04) v1(137.52,101.96) v1(137.52,96.88) v1(137.52,91.8) v1(137.52,86.72) v1(137.52,81.64) v1(137.52,76.56) v1(137.52,71.48) v1(137.52,66.4) v1(137.52,61.32) v1(137.52,56.24) v1(137.52,51.16) v1(137.52,46.08) v1(137.52,41) v1(137.52,35.92) v1(137.52,30.84) v1(137.52,25.76) v1(137.52,20.68) v1(137.52,15.6) v1(137.52,10.52) v1(137.52,5.44) v1(142.6,107.04) v1(142.6,101.96) v1(142.6,96.88) v1(142.6,91.8) v1(142.6,86.72) v1(142.6,81.64) v1(142.6,76.56) v1(142.6,71.48) v1(142.6,66.4) v1(142.6,61.32) v1(142.6,56.24) v1(142.6,51.16) v1(142.6,46.08) v1(142.6,41) v1(142.6,35.92) v1(142.6,30.84) v1(142.6,25.76) v1(142.6,20.68) v1(142.6,15.6) v1(142.6,10.52) v1(142.6,5.44) v1(147.68,107.04) v1(147.68,101.96) v1(147.68,96.88) v1(147.68,91.8) v1(147.68,86.72) v1(147.68,81.64) v1(147.68,76.56) v1(147.68,71.48) v1(147.68,66.4) v1(147.68,61.32) v1(147.68,56.24) v1(147.68,51.16) v1(147.68,46.08) v1(147.68,41) v1(147.68,35.92) v1(147.68,30.84) v1(147.68,25.76) v1(147.68,20.68) v1(147.68,15.6) v1(147.68,10.52) v1(147.68,5.44) v1(152.76,107.04) v1(152.76,101.96) v1(152.76,96.88) v1(152.76,91.8) v1(152.76,86.72) v1(152.76,81.64) v1(152.76,76.56) v1(152.76,71.48) v1(152.76,66.4) v1(152.76,61.32) v1(152.76,56.24) v1(152.76,51.16) v1(152.76,46.08) v1(152.76,41) v1(152.76,35.92) v1(152.76,30.84) v1(152.76,25.76) v1(152.76,20.68) v1(152.76,15.6) v1(152.76,10.52) v1(152.76,5.44) v1(157.84,107.04) v1(157.84,101.96) v1(157.84,96.88) v1(157.84,91.8) v1(157.84,86.72) v1(157.84,81.64) v1(157.84,76.56) v1(157.84,71.48) v1(157.84,66.4) v1(157.84,61.32) v1(157.84,56.24) v1(157.84,51.16) v1(157.84,46.08) v1(157.84,41) v1(157.84,35.92) v1(157.84,30.84) v1(157.84,25.76) v1(157.84,20.68) v1(157.84,15.6) v1(157.84,10.52) v1(157.84,5.44) v1(162.92,107.04) v1(162.92,101.96) v1(162.92,96.88) v1(162.92,91.8) v1(162.92,86.72) v1(162.92,81.64) v1(162.92,76.56) v1(162.92,71.48) v1(162.92,66.4) v1(162.92,61.32) v1(162.92,56.24) v1(162.92,51.16) v1(162.92,46.08) v1(162.92,41) v1(162.92,35.92) v1(162.92,30.84) v1(162.92,25.76) v1(162.92,20.68) v1(162.92,15.6) v1(162.92,10.52) v1(162.92,5.44) v1(168,107.04) v1(168,101.96) v1(168,96.88) v1(168,91.8) v1(168,86.72) v1(168,81.64) v1(168,76.56) v1(168,71.48) v1(168,66.4) v1(168,61.32) v1(168,56.24) v1(168,51.16) v1(168,46.08) v1(168,41) v1(168,35.92) v1(168,30.84) v1(168,25.76) v1(168,20.68) v1(168,15.6) v1(168,10.52) v1(168,5.44) v1(173.08,107.04) v1(173.08,101.96) v1(173.08,96.88) v1(173.08,91.8) v1(173.08,86.72) v1(173.08,81.64) v1(173.08,76.56) v1(173.08,71.48) v1(173.08,66.4) v1(173.08,61.32) v1(173.08,56.24) v1(173.08,51.16) v1(173.08,46.08) v1(173.08,41) v1(173.08,35.92) v1(173.08,30.84) v1(173.08,25.76) v1(173.08,20.68) v1(173.08,15.6) v1(173.08,5.44) v1(178.16,107.04) v1(178.16,96.88) v1(178.16,91.8) v1(178.16,86.72) v1(178.16,81.64) v1(178.16,76.56) v1(178.16,71.48) v1(178.16,66.4) v1(178.16,61.32) v1(178.16,56.24) v1(178.16,51.16) v1(178.16,46.08) v1(178.16,41) v1(178.16,35.92) v1(178.16,30.84) v1(178.16,25.76) v1(178.16,20.68) v1(178.16,15.6) v1(178.16,5.44) v1(183.24,91.8) v1(183.24,86.72) v1(183.24,81.64) v1(183.24,76.56) v1(183.24,71.48) v1(183.24,66.4) v1(183.24,61.32) v1(183.24,51.16) v1(183.24,46.08) v1(183.24,41) v1(183.24,35.92) v1(183.24,30.84) v1(183.24,25.76) v1(183.24,20.68) v1(188.32,91.8) v1(188.32,86.72) v1(188.32,81.64) v1(188.32,76.56) v1(188.32,71.48) v1(188.32,66.4) v1(188.32,61.32) v1(188.32,56.24) v1(188.32,51.16) v1(188.32,46.08) v1(188.32,41) v1(188.32,35.92) v1(188.32,30.84) v1(188.32,25.76) v1(188.32,20.68)
CAL_BTN: length 99.6
  Top Layer w0.254: 12.03,68.43 18.3,62.16 18.3,42.71 36.47,24.54 38.08,24.54 38.13,24.59 38.13,24.59 39.89,26.35 39.89,41.13 42.3,43.54 62.87,43.54 CAL_BTN.1
CAL_LED: length 6.7
  Top Layer w0.254: CAL_BTN.3 59.77,52.15 R2.1
DIR: length 64.1
  Top Layer w0.254: 12.03,58.27 16.88,53.42 16.88,42.12 35.88,23.12 38.69,23.12 41.34,25.77 41.34,35.58 43.08,37.32 MOTOR.4
ENC_A: length 70
  Top Layer w0.254: 12.03,50.65 15.81,46.87 15.81,41.68 40.36,17.12 60.81,17.12 61.79,18.1 64.71,18.1
ENC_A_10V: length 4.4
  Top Layer w0.254: ENCODER.3 59.9,27.31 R3.1
ENC_B: length 65.4
  Top Layer w0.254: 12.03,53.19 16.17,49.06 16.17,41.82 39.77,18.22 R5.2 R6.1
ENC_B_10V: length 4.3
  Top Layer w0.254: R5.1 57.4,27.13 ENCODER.4
GPIO0: length 68.9
  Bottom Layer w0.254: 37.43,48.37 33.11,44.04 33.11,11.64 35.47,9.28 55.79,9.28 H1.13
GPIO1: length 78.4
  Bottom Layer w0.254: 37.43,73.51 30.26,66.34 30.26,10.42 34.24,6.43 38.32,6.43 H1.5
GPIO2: length 78.2
  Bottom Layer w0.254: 37.43,71.23 30.62,64.41 30.62,10.56 34.39,6.79 40.63,6.79 42.74,4.68 H1.6
GPIO9: length 48.5
  Bottom Layer w0.254: H1.1 18.86,15.73 18.86,38.74 12.03,45.57
GPIO10: length 44.8
  Bottom Layer w0.254: 12.03,43.03 18.51,36.56 18.51,13.29 H2.5
GPIO11: length 41.2
  Bottom Layer w0.254: 12.03,40.49 18.15,34.38 18.15,11.1 H2.4
GPIO12: length 37.6
  Bottom Layer w0.254: 12.03,37.95 17.79,32.19 17.79,8.92 H2.3
GPIO13: length 34.1
  Bottom Layer w0.254: H2.2 17.44,6.74 17.44,30.1 12.13,35.41 12.03,35.41
GPIO14: length 30.4
  Bottom Layer w0.254: H2.1 17.08,27.82 12.03,32.87
GPIO19: length 65.3
  Bottom Layer w0.254: 37.43,33.13 35.24,30.94 35.24,12.53 36.34,11.44 68.87,11.44 H1.19
GPIO20: length 65.9
  Bottom Layer w0.254: H1.18 66.69,11.08 36.19,11.08 34.89,12.39 34.89,33.12 37.43,35.67
GPIO21: length 66.6
  Bottom Layer w0.254: 37.43,38.21 37.3,38.21 34.53,35.43 34.53,12.24 36.05,10.72 64.5,10.72 H1.17
GPIO35: length 69.5
  Bottom Layer w0.254: H1.12 53.6,8.92 35.27,8.92 32.75,11.45 32.75,46.23 37.43,50.91
GPIO36: length 70.1
  Bottom Layer w0.254: 37.43,53.45 32.4,48.41 32.4,11.3 35.13,8.57 51.42,8.57 H1.11
GPIO37: length 70.7
  Bottom Layer w0.254: H1.10 49.24,8.21 34.98,8.21 32.04,11.15 32.04,50.59 37.43,55.99
GPIO38: length 71.2
  Bottom Layer w0.254: 37.43,58.53 31.68,52.78 31.68,11.01 34.83,7.86 47.05,7.86 H1.9
GPIO39: length 71.8
  Bottom Layer w0.254: H1.8 44.87,7.5 34.69,7.5 31.33,10.86 31.33,54.96 37.43,61.07
GPIO40: length 72.4
  Bottom Layer w0.254: H1.7 42.68,7.14 34.54,7.14 30.97,10.71 30.97,57.15 37.43,63.61
GPIO45: length 68.3
  Bottom Layer w0.254: H1.14 57.97,9.64 35.62,9.64 33.46,11.79 33.46,41.86 37.43,45.83
GPIO46: length 52.1
  Bottom Layer w0.254: 12.03,48.11 19.22,40.93 19.22,17.91 H1.2
GPIO47: length 67.1
  Bottom Layer w0.254: H1.16 62.32,10.37 35.9,10.37 34.18,12.09 34.18,37.49 37.43,40.75
GPIO48: length 67.7
  Bottom Layer w0.254: H1.15 60.13,10.01 35.75,10.01 33.82,11.94 33.82,39.67 37.43,43.29
GPS_RXD: length 137.9
  Top Layer w0.254: GPS.3 54.95,42.27 41.54,42.27 40.25,40.98 40.25,26.2 38.28,24.23 38.27,24.23 38.23,24.19 36.32,24.19 17.95,42.56 17.95,59.98 12.03,65.89
  Bottom Layer w0.254: 12.03,65.89 13.8,67.67 13.8,92.25 21.53,99.97 21.53,104.27 R7.1
GPS_TXD: length 130.8
  Top Layer w0.254: GPS.4 52.8,41.91 41.85,41.91 40.6,40.67 40.6,26.06 39.56,25.01 39.56,25 38.39,23.83 36.18,23.83 17.59,42.41 17.59,57.79 12.03,63.35
  Bottom Layer w0.254: 12.03,63.35 14.16,65.48 14.16,92.1 R8.1
OLED_SCL: length 27.1
  Bottom Layer w0.254: 37.43,68.43 46.04,68.43 OLED.3
OLED_SDA: length 30.7
  Bottom Layer w0.254: OLED.4 46.04,65.89 37.43,65.89
PWM: length 71.2
  Top Layer w0.254: 12.03,60.81 17.24,55.61 17.24,42.27 36.03,23.47 38.54,23.47 40.96,25.89 40.96,37.95 41.97,38.97 44.15,38.97 MOTOR.3
PWR_LED: length 7.7
  Top Layer w0.254: POWER_BTN.3 48.62,48.26 R1.1
U0RXD: length 79.5
  Bottom Layer w0.254: H1.4 37.66,5.44 37.02,6.08 34.1,6.08 29.9,10.27 29.9,68.52 37.43,76.05
U0TXD: length 79.6
  Bottom Layer w0.254: 37.43,78.59 29.55,70.71 29.55,10.12 H1.3
WORK: length 57.9
  Top Layer w0.254: 12.03,55.73 16.52,51.24 16.52,41.97 35.74,22.76 38.83,22.76 41.7,25.62 41.7,28.56 42.12,28.97 42.12,29.02 42.78,29.68 44.66,29.68 WORK_SW.1
$1N1645: length 1.9
  Top Layer w0.254: GPS_TXD.2 R8.2
$1N1646: length 1.9
  Top Layer w0.254: R7.2 GPS_RXD.2
$1N2047: length 88
  Top Layer w0.254: R1.2 39.18,49.94 39.18,26.65 37.78,25.25 36.77,25.25 19.02,43 19.02,66.53 12.03,73.51
$1N2051: length 97.6
  Top Layer w0.254: R2.2 51.46,53.32 44.01,53.32 39.54,48.85 39.54,26.5 38.16,25.13 38.16,25.13 37.98,24.95 37.98,24.95 37.93,24.9 36.62,24.9 18.66,42.86 18.66,64.34 12.03,70.97

## Copper pours and planes (outline as drawn; the poured copper is in the pictures)
GND on Top Layer: -6.03,119.23 197.42,119.23 197.42,-7.64 -6.03,-7.64
GND on Bottom Layer: -5.9,119.74 197.55,119.74 197.55,-7.13 -5.9,-7.13
VIN on Top Layer: 95.31,71.48 95.31,94.09 78.04,111.36 51.37,111.36 49.07,109.06 49.07,103.24 51.61,103.24 51.75,103.24 51.75,105.77 53.4,107.42 59.84,107.42 61.27,106 61.27,103.1 64.39,103.1 64.39,106.28 66.05,106.28 70.93,100.82 70.93,87.61 76.77,81.77 76.77,71.48

## Text on the board
Bottom Silkscreen Layer: THIS BOARD DESIGNED BY TREVOR KIDD / FOR S5 FARMS LTD.  ALL DOCUMENTATION / CAN BE FOUND AT: / https://github.com/kamikaze2112/Valmar1665
Top Silkscreen Layer: 14 | 13 | 12 | 11 | 10 | 09 | 46 | TXD | RXD | 01 | 02 | 40 | 39 | 38 | 37 | 36 | 35 | 00 | 45 | 48 | 47 | 21 | 20 | 19 | GPIO | GND | VIN
